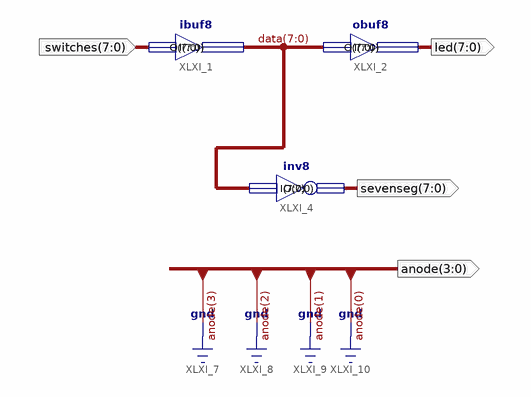
[diagram p0: schematic sheet 1]
// Xilinx ISE schematic toplevel2.sch (spartan3e) as structural Verilog: 3 symbols, 5 ports
module toplevel2 (
  input  [7:0] switches,
  output [7:0] data,
  output [7:0] led,
  output [7:0] sevenseg,
  output [3:0] anode
);

  ibuf8 XLXI_1 (.I(switches), .O(data));
  obuf8 XLXI_2 (.I(data), .O(led));
  inv8 XLXI_4 (.I(data), .O(sevenseg));

  assign anode = 4'b0000;
endmodule
